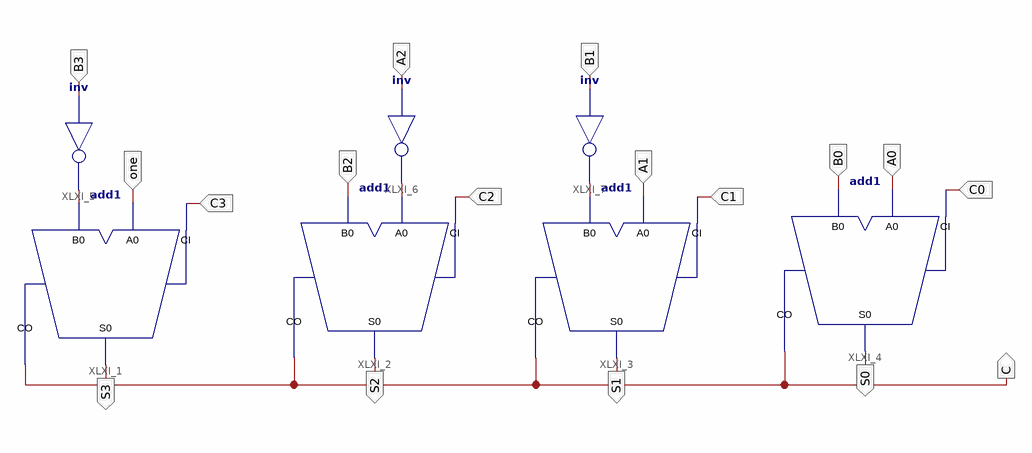
[diagram p0: schematic sheet 1]
// Xilinx ISE schematic lab2_FA_sch.sch (xa9500xl) as structural Verilog: 7 symbols, 17 ports
module lab2_FA_sch (
  input  B3,
  input  one,
  input  A2,
  input  B2,
  input  B1,
  input  A1,
  input  A0,
  input  B0,
  input  C3,
  input  C2,
  input  C1,
  input  C0,
  output C,
  output S0,
  output S1,
  output S2,
  output S3
);

  wire XLXN_3, XLXN_4, XLXN_5;

  add1 XLXI_1 (.A0(one), .B0(XLXN_3), .CI(C3), .CO(C), .S0(S3));
  add1 XLXI_2 (.A0(XLXN_4), .B0(B2), .CI(C2), .CO(C), .S0(S2));
  add1 XLXI_3 (.A0(A1), .B0(XLXN_5), .CI(C1), .CO(C), .S0(S1));
  add1 XLXI_4 (.A0(A0), .B0(B0), .CI(C0), .CO(C), .S0(S0));
  not XLXI_5 (XLXN_3, B3);
  not XLXI_6 (XLXN_4, A2);
  not XLXI_7 (XLXN_5, B1);
endmodule
